# EAGLE design tape_power_adapter (EAGLE 9.6.1)
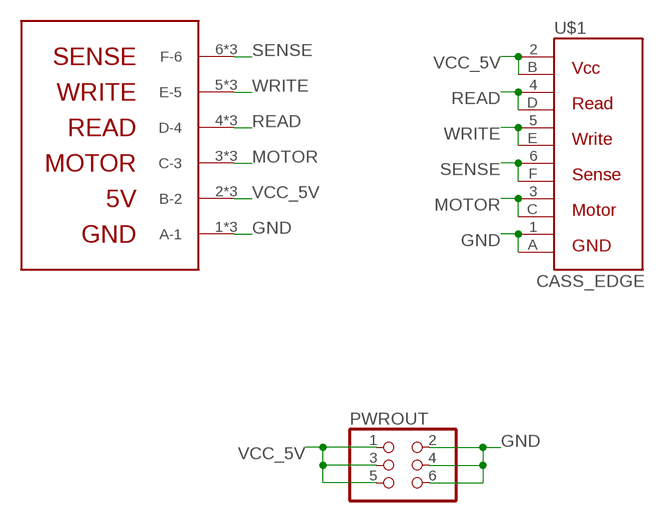
[diagram p0: schematic, sheet 1]

## Parts
PWROUT  PINHD-2X03_2.54  [2X03]
U$1  CASS_EDGE  [12PINEDGE]
U$2  C64CASSCONN  [C64TAPECONN]

## Nets
GND: PWROUT.2 PWROUT.4 PWROUT.6 U$1.1(GND1) U$1.A(GND2) U$2.1(A-1) U$2.1A(A-1) U$2.A(A-1)
MOTOR: U$1.3(MOTOR1) U$1.C(MOTOR2) U$2.3(C-3) U$2.3C(C-3) U$2.C(C-3)
READ: U$1.4(READ1) U$1.D(READ2) U$2.4(D-4) U$2.4D(D-4) U$2.D(D-4)
SENSE: U$1.6(SENSE1) U$1.F(SENSE2) U$2.6(F-6) U$2.6F(F-6) U$2.F(F-6)
VCC_5V: PWROUT.1 PWROUT.3 PWROUT.5 U$1.2(VCC1) U$1.B(VCC2) U$2.2(B-2) U$2.2B(B-2) U$2.B(B-2)
WRITE: U$1.5(WRITE1) U$1.E(WRITE2) U$2.5(E-5) U$2.5E(E-5) U$2.E(E-5)

## Library data of the parts
PWROUT = pinhead-2:PINHD-2X03: PIN HEADER
U$1 = commodore:CASS_EDGE
U$2 = rakettitiede:C64CASSCONN

## Board
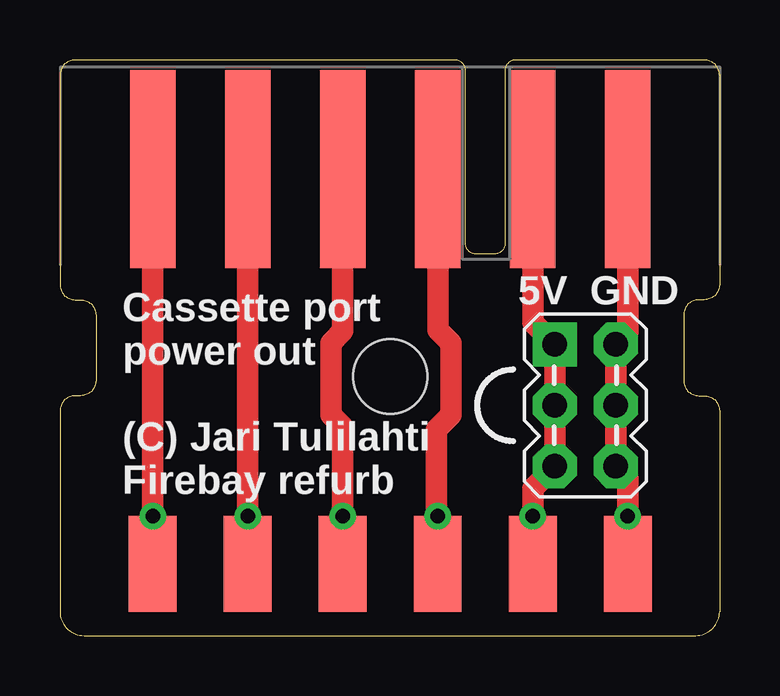
[diagram p1: board, top side]
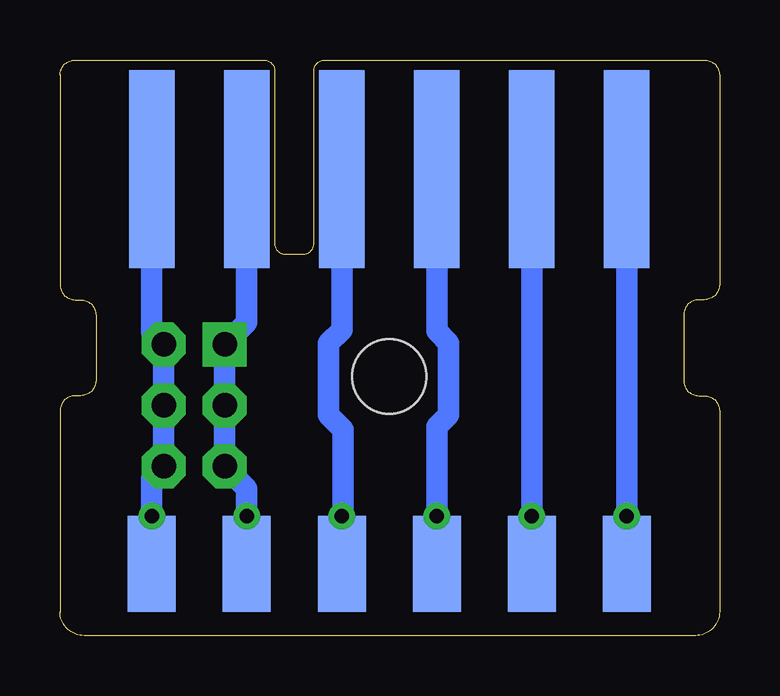
[diagram p2: board, bottom side, seen from below]

Size 27.5 x 24 mm. Coordinates in mm from the lower left corner, seen from the top.
Outline: 0,23.36 0,14.64 arc90 0.64,14 0.86,14 arc-90 1.5,13.36 1.5,10.64 arc-90 0.86,10 0.64,10 arc90 0,9.36 0,1 arc90 1,0 26.5,0 arc90 27.5,1 27.5,9.36 arc90 26.86,10 26.63,10 arc-90 26,10.64 26,13.36 arc-90 26.63,14 26.86,14 arc90 27.5,14.64 27.5,23.36 arc90 26.86,24 19,24 arc90 18.55,23.55 18.55,16.35 arc-90 18.1,15.9 17.36,15.9 arc-90 16.91,16.35 16.91,23.55 arc90 16.46,24 0.64,24 arc90 0,23.36
Copper layers (1*16): Top 0.035mm / dielectric 1.6mm / Bottom 0.035mm
Design rules "jlcpcb-2layers": minimum track width 5mil, minimum drill 0.3mm, track to track 5mil, track to pad 5mil, pad to pad 5mil, via to via 5mil, smd to smd 5mil, copper to edge 0.2mm, drill to drill 6mil, minimum pad ring 10mil, minimum via ring 3mil, stop-mask expansion 4mil, vias tented up to drill 0mil, thermal gap 10mil
Holes 3.1 mm at 13.77,10.8

### Footprints (pad centres in the part's own frame; a part is rotated, then mirrored left to right if it is on the bottom)
2X03 = drill 1.016 square: 1 -2.54,-1.27 | drill 1.016 octagon: 2 -2.54,1.27; 3 0,-1.27; 4 0,1.27; 5 2.54,-1.27; 6 2.54,1.27
12PINEDGE = smd 1.905 x 8.255: 1 9.9,0.254; 2 5.94,0.254; 3 1.98,0.254; 4 -1.98,0.254; 5 -5.94,0.254; 6 -9.9,0.254 | smd 1.905 x 8.255 bottom: A 9.9,0.254; B 5.94,0.254; C 1.98,0.254; D -1.98,0.254; E -5.94,0.254; F -9.9,0.254
C64TAPECONN = smd 2 x 4: 1 9.9,0; 2 5.94,0; 3 1.98,0; 4 -1.98,0; 5 -5.94,0; 6 -9.9,0 | drill 0.6: 1A 9.9,1.98; 2B 5.94,1.98; 3C 1.98,1.98; 4D -1.98,1.98; 5E -5.94,1.98; 6F -9.9,1.98 | smd 2 x 4 bottom: A 9.9,0; B 5.94,0; C 1.98,0; D -1.98,0; E -5.94,0; F -9.9,0

### Placement (x,y rotation side)
PWROUT  21.9,9.6 270 top
U$1  13.77,19.2 0 top
U$2  13.77,3 0 top

### Tracks (layer width: path | path; a pad name or v marks a point on that pad's centre or on a via)
GND
  Top 0.9: U$1.1 23.67,12.64 PWROUT.2 PWROUT.6 23.67,6.56 U$2.1A U$2.1
  Bottom 0.9: U$1.1 23.67,12.64 PWROUT.2 PWROUT.4 PWROUT.6 23.67,6.56 U$2.1 U$2.1A
MOTOR
  Top 0.9: U$1.3 15.75,12.75 16.3,12.2 16.3,9.2 15.7,8.6 15.7,5.03 U$2.3C U$2.C
  Bottom 0.9: U$1.3 15.75,12.75 16.3,12.2 16.3,9.2 15.7,8.6 15.7,5.03 U$2.3C U$2.C
READ
  Top 0.9: U$1.4 11.79,12.69 11.3,12.2 11.3,9.2 11.79,8.71 U$2.4D U$2.D
  Bottom 0.9: U$1.4 11.79,12.69 11.3,12.2 11.3,9.2 11.79,8.71 U$2.4D 11.9,4.87 11.9,4.4 11.79,4.29 U$2.D
SENSE
  Top 0.9: U$1.6 U$2.6F U$2.6
  Bottom 0.9: U$1.6 U$2.6F U$2.6
VCC_5V
  Top 0.9: U$1.B 19.71,13.06 PWROUT.1 PWROUT.5 19.71,6.14 U$2.2
  Bottom 0.9: U$1.B 19.71,13.06 PWROUT.1 PWROUT.3 PWROUT.5 19.71,6.14 U$2.2B U$2.2
WRITE
  Top 0.9: U$1.5 U$2.5E U$2.E
  Bottom 0.9: U$1.5 U$2.5E U$2.E

### Text on the board
tPlace: 5V | GND | Cassette port / power out / / (C) Jari Tulilahti / Firebay refurb